# Altium schematic sheet 501_RPi0.SchDoc: RPi Zero Wireless
size A2; Organization: Greenfield Tech Solutions; Address1: Molendreef 33; Address2: Ossendrecht; Address3: 4641CS; Address4: The Netherlands; SheetNumber: 6; SheetTotal: 9
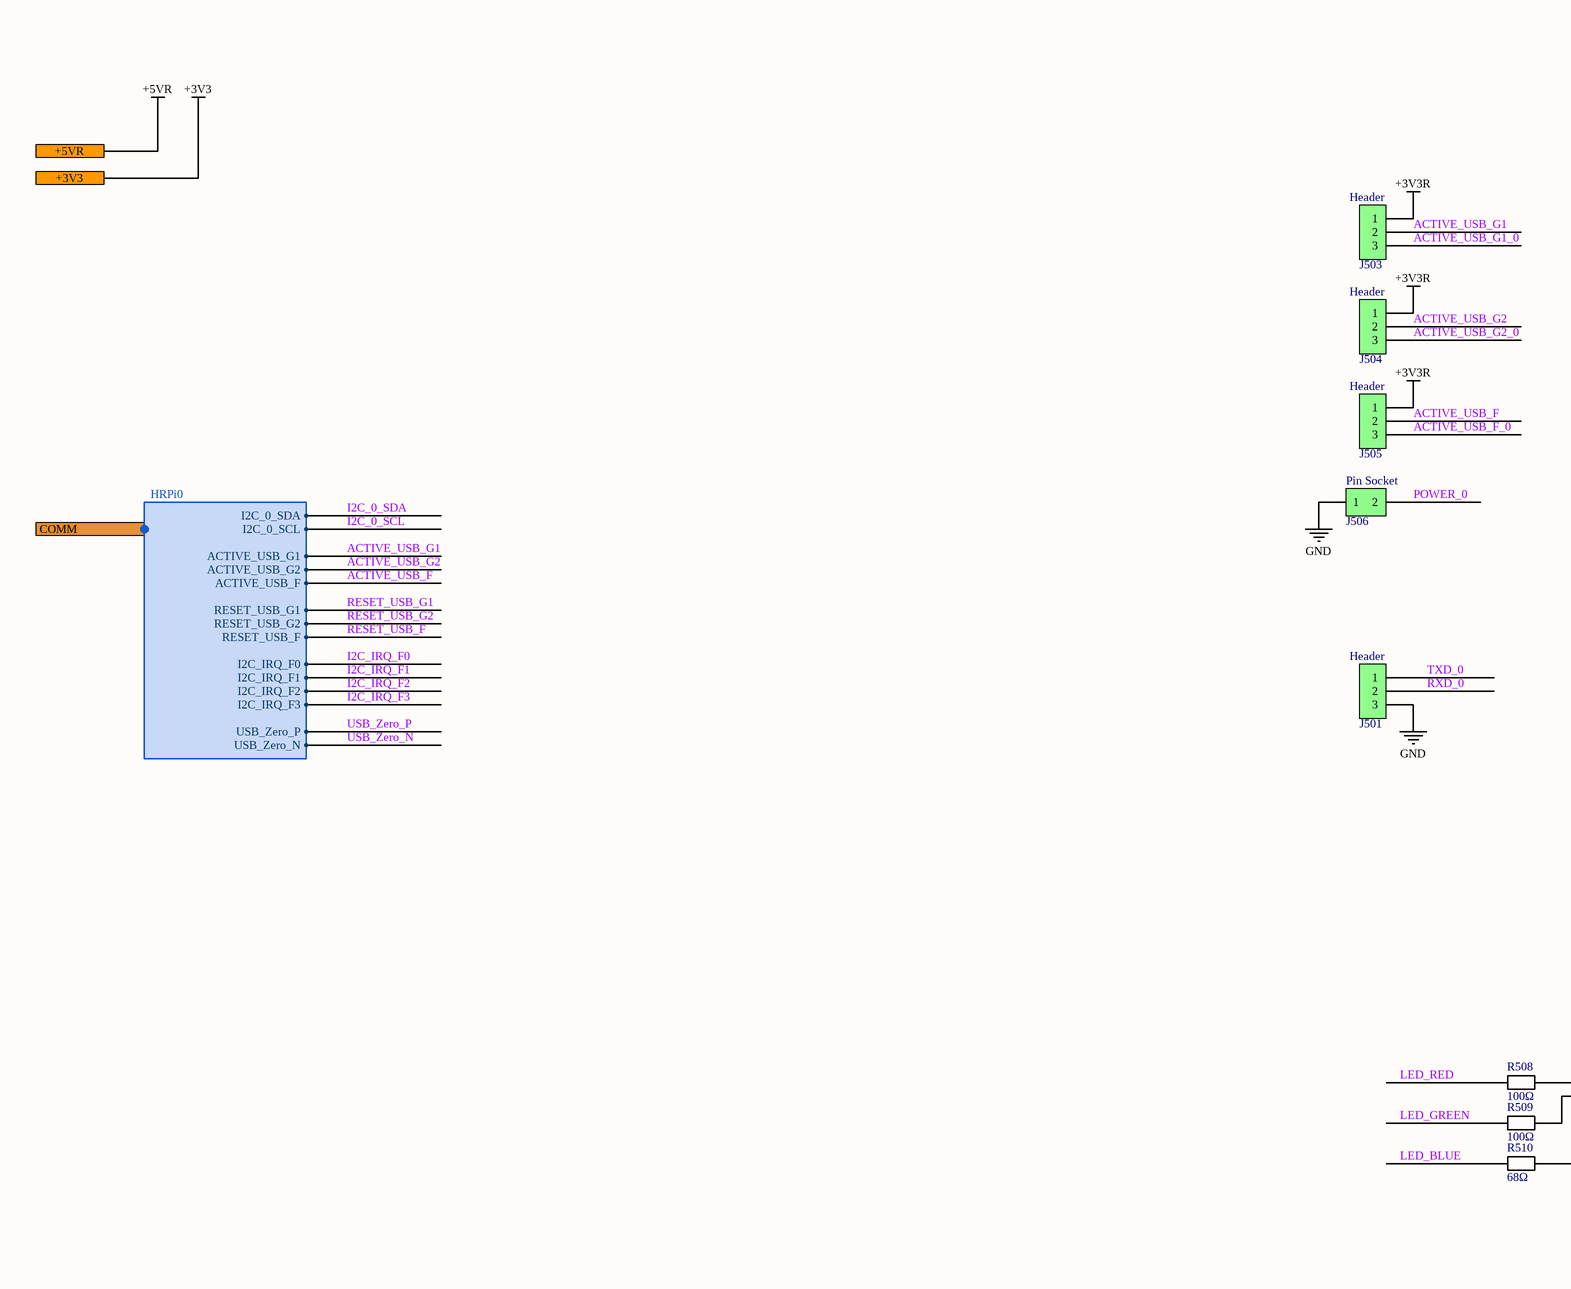
[diagram p0: 501_RPi0.SchDoc, left]
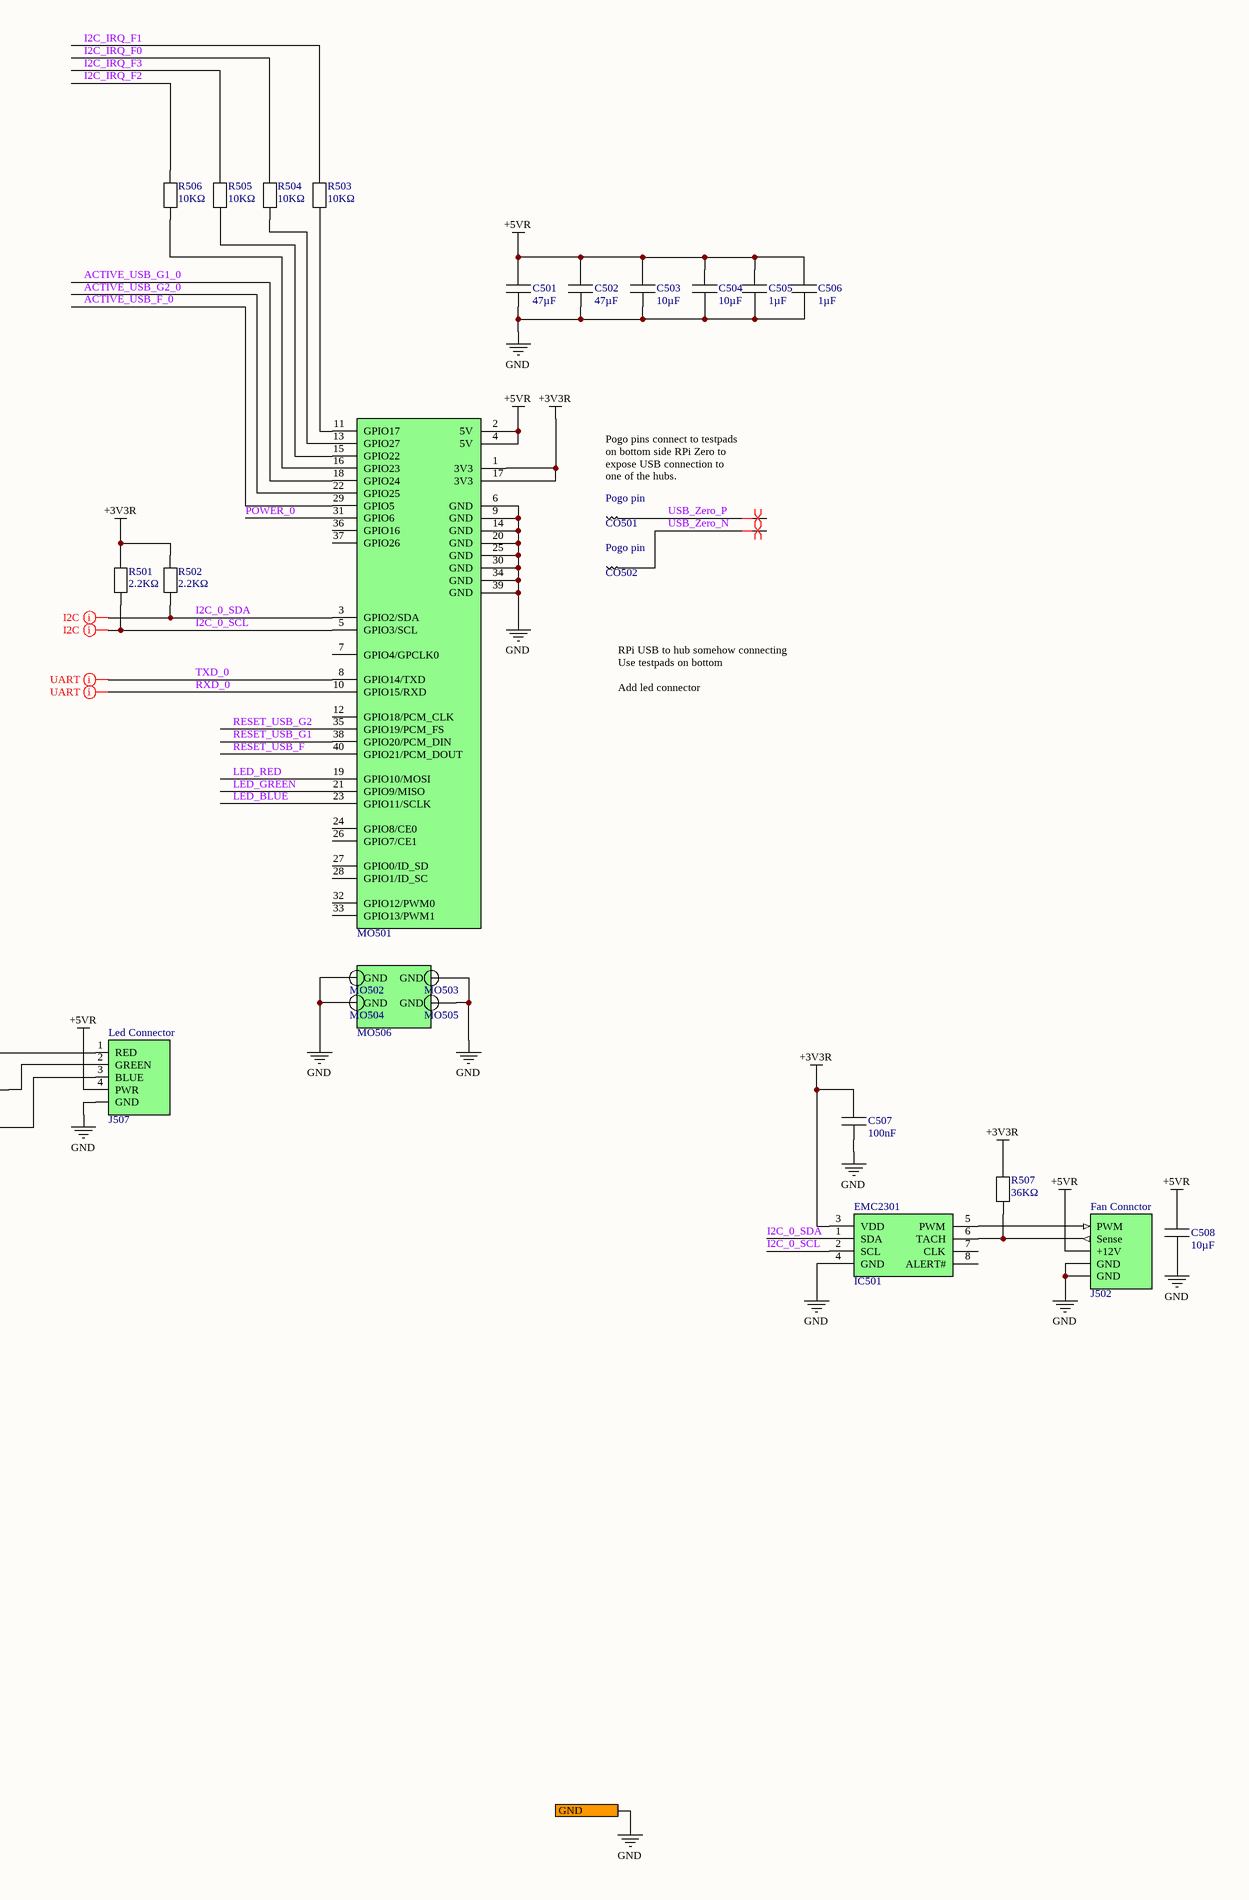
[diagram p1: 501_RPi0.SchDoc, right]

## Parts
C501  47µF  [C1210]
C502  47µF  [C1210]
C503  10µF  [C0805]
C504  10µF  [C0805]
C505  1µF  [C0603]
C506  1µF  [C0603]
C507  100nF  [C0402]
C508  10µF  [C0805]
CO501  Pogo pin  [POGO-0906]
CO502  Pogo pin  [POGO-0906]
IC501  EMC2301  [MSOP-8_3X3]
J501  Header  [1X3P_2.54mm]
J502  Fan Connctor  [SM04B]
J503  Header  [1X3P_2.54mm]
J504  Header  [1X3P_2.54mm]
J505  Header  [1X3P_2.54mm]
J506  Pin Socket  [1X2P_Socket_2.54mm]
J507  Led Connector  [SM04B]
MO501  ZeroW-1  [RPIZeroW_Pins]  (value not drawn)
MO502  ZeroW-M  [CM4-M]  (value not drawn)
MO503  ZeroW-M  [CM4-M]  (value not drawn)
MO504  ZeroW-M  [CM4-M]  (value not drawn)
MO505  ZeroW-M  [CM4-M]  (value not drawn)
MO506  ZeroW  [RPIZeroW_Layout]  (value not drawn)
R501  2.2KΩ  [R0402]
R502  2.2KΩ  [R0402]
R503  10KΩ  [R0402]
R504  10KΩ  [R0402]
R505  10KΩ  [R0402]
R506  10KΩ  [R0402]
R507  36KΩ  [R0402]
R508  100Ω  [R0402]
R509  100Ω  [R0402]
R510  68Ω  [R0402]

## Ports
+3V3, +5VR, COMM (harness HRPi0), GND

## Harnesses
HRPi0: I2C_0_SCL, I2C_0_SDA, I2C_IRQ_F0, I2C_IRQ_F1, I2C_IRQ_F3, I2C_IRQ_F2, ACTIVE_USB_G1, ACTIVE_USB_F, ACTIVE_USB_G2, RESET_USB_G1, RESET_USB_F, RESET_USB_G2, USB_Zero_N, USB_Zero_P

## Nets
+3V3: port +3V3
+3V3R: C507.1 IC501.3(VDD) J503.1 J504.1 J505.1 MO501.1(3V3) MO501.17(3V3) R501.2 R502.2 R507.2
+5VR: C501.1 C502.1 C503.1 C504.1 C505.1 C506.1 C508.1 J502.3(+12V) J507.4(PWR) MO501.2(5V) MO501.4(5V) ; port +5VR
GND: C501.2 C502.2 C503.2 C504.2 C505.2 C506.2 C507.2 C508.2 IC501.4(GND) J501.3 J502.4(GND) J502.5(GND) J506.1 J507.5(GND) MO501.6(GND) MO501.9(GND) MO501.14(GND) MO501.20(GND) MO501.25(GND) MO501.30(GND) MO501.34(GND) MO501.39(GND) MO502.GND MO503.GND MO504.GND MO505.GND ; port GND
ACTIVE_USB_F: J505.2 ; port COMM.ACTIVE_USB_F
ACTIVE_USB_F_0: J505.3 MO501.29(GPIO5)
ACTIVE_USB_G1: J503.2 ; port COMM.ACTIVE_USB_G1
ACTIVE_USB_G1_0: J503.3 MO501.18(GPIO24)
ACTIVE_USB_G2: J504.2 ; port COMM.ACTIVE_USB_G2
ACTIVE_USB_G2_0: J504.3 MO501.22(GPIO25)
I2C_0_SCL: IC501.2(SCL) MO501.5(GPIO3/SCL) R501.1 ; port COMM.I2C_0_SCL
I2C_0_SDA: IC501.1(SDA) MO501.3(GPIO2/SDA) R502.1 ; port COMM.I2C_0_SDA
I2C_IRQ_F0: R504.2 ; port COMM.I2C_IRQ_F0
I2C_IRQ_F1: R503.2 ; port COMM.I2C_IRQ_F1
I2C_IRQ_F2: R506.2 ; port COMM.I2C_IRQ_F2
I2C_IRQ_F3: R505.2 ; port COMM.I2C_IRQ_F3
LED_BLUE: MO501.23(GPIO11/SCLK) R510.1
LED_GREEN: MO501.21(GPIO9/MISO) R509.1
LED_RED: MO501.19(GPIO10/MOSI) R508.1
POWER_0: J506.2 MO501.31(GPIO6)
RESET_USB_F: MO501.40(GPIO21/PCM_DOUT) ; port COMM.RESET_USB_F
RESET_USB_G1: MO501.38(GPIO20/PCM_DIN) ; port COMM.RESET_USB_G1
RESET_USB_G2: MO501.35(GPIO19/PCM_FS) ; port COMM.RESET_USB_G2
RXD_0: J501.2 MO501.10(GPIO15/RXD)
TXD_0: J501.1 MO501.8(GPIO14/TXD)
USB_Zero_N: CO502.1 ; port COMM.USB_Zero_N
USB_Zero_P: CO501.1 ; port COMM.USB_Zero_P
NetIC501_5: IC501.5(PWM) J502.1(PWM)
NetIC501_6: IC501.6(TACH) J502.2(Sense) R507.1
NetJ507_1: J507.1(RED) R508.2
NetJ507_2: J507.2(GREEN) R509.2
NetJ507_3: J507.3(BLUE) R510.2
NetMO501_11: MO501.11(GPIO17) R503.1
NetMO501_13: MO501.13(GPIO27) R504.1
NetMO501_15: MO501.15(GPIO22) R505.1
NetMO501_16: MO501.16(GPIO23) R506.1

Not connected (* = marked no-connect by the designer): IC501 7(CLK) 8(ALERT#); MO501 7(GPIO4/GPCLK0) 12(GPIO18/PCM_CLK) 24(GPIO8/CE0) 26(GPIO7/CE1) 27(GPIO0/ID_SD) 28(GPIO1/ID_SC) 32(GPIO12/PWM0) 33(GPIO13/PWM1) 36(GPIO16) 37(GPIO26)

## Layout directives
net class I2C_0: I2C_0_SCL, I2C_0_SDA
net class UART_0: RXD_0, TXD_0
differential pair; differential pair class USB3: USB_Zero_N, USB_Zero_P

## Notes on the sheet
- (near CO501) Pogo pins connect to testpads on bottom side RPi Zero to expose USB connection to one of the hubs.
- RPi USB to hub somehow connecting
  Use testpads on bottom
  Add led connector
- Title
- Size:
- Date:
- File:
- A2
- Number:
- Time:
- Revision:
- Sheet
- of

## Library data of the parts
C501 C502 = CA0007: 47µF 16V 20% X5R; Part Number: CA0007; ManfactPart: EMK325ABJ476MM8P; ID: 7; RefVal: 47µF
C503 C504 C508 = CA0001: 10µF 16V 10% X5R; Part Number: CA0001; ManfactPart: GRM21BR61C106KE15L; ID: 1; RefVal: 10µF
C505 C506 = CA0003: 1µF 16V 10% X5R; Part Number: CA0003; ManfactPart: C1608X5R1C105K080AA; ID: 3; RefVal: 1µF
C507 = CA0010: 100nF 16V 10% X7R; Part Number: CA0010; ManfactPart: GCM155R71C104KA55D; ID: 10; RefVal: 100nF
CO501 CO502 = CO0058: Pogo pin 3mm TH; Part Number: CO0058; ManfactPart: 0906-0-15-20-76-14-11-0; ID: 58; RefVal: Pogo pin
IC501 = IC0054: Board Mount Temperature Sensors Single RPB-Based PWM Fan Speed CNTRL; Part Number: IC0054; ManfactPart: EMC2301-1-ACZL-TR; ID: 54; RefVal: EMC2301
J501 J503-J505 = CO0018: Header 1x3P; Part Number: CO0018; ManfactPart: G800W305018EU; ID: 32; RefVal: Header
J502 = CO0055: Connector Header SMD R/A 4POS 1MM; Part Number: CO0055; ManfactPart: SM04B-SRSS-TB; ID: 55; RefVal: Fan Connctor
J506 = CO0060: Socket Strip with Square Tails; Part Number: CO0060; ManfactPart: SSQ-102-02-S-S; ID: 60; RefVal: Pin Socket
J507 = CO0056: Connector Header SMD R/A 4POS 1MM for LED4PG-15-23B/R6G6BHC-A01/2T; Part Number: CO0056; ManfactPart: SM04B-SRSS-TB; ID: 56; RefVal: Led Connector
MO501 = MO0018: RPI ZeroW Pin 1-40; Part Number: MO0018; ManfactPart: 61304021121; ID: 18; RefVal: ZeroW-1
MO502-MO505 = MO0016: RPI ZeroW Mounting Studs; Part Number: MO0016; ManfactPart: 9774030151R; ID: 16; RefVal: ZeroW-M
MO506 = MO0015: Outline of ZeroW; Part Number: MO0015; ManfactPart: RPI Zero W; ID: 15; RefVal: ZeroW
R501 R502 = RS0020: 2.2KΩ 5% 62.5mW; Part Number: RS0020; ManfactPart: MCMR04X222 JTL; ID: 20; RefVal: 2.2KΩ
R503-R506 = RS0011: 10KΩ 1% 62.5mW; Part Number: RS0011; ManfactPart: WR04X1002FTL; ID: 11; RefVal: 10KΩ
R507 = RS0051: 36KΩ 1% 62.5mW 100PPM; Part Number: RS0051; ManfactPart: ERJ-2RKF3602X; ID: 51; RefVal: 36KΩ
R508 R509 = RS0082: 120Ω 1% 62.5mW 100PPM; Part Number: RS0082; ManfactPart: CRG0402F120R; ID: 82; RefVal: 100Ω
R510 = RS0081: 68Ω 1% 62.5mW 100PPM; Part Number: RS0081; ManfactPart: CR0402-FX-68R0GLF; ID: 81; RefVal: 68Ω